# Altium schematic sheet SP26_FindingTitan_Digital Circuitry_Prakul Swaminath.SchDoc.SchDoc
size A; SheetNumber: 6; SheetTotal: 6
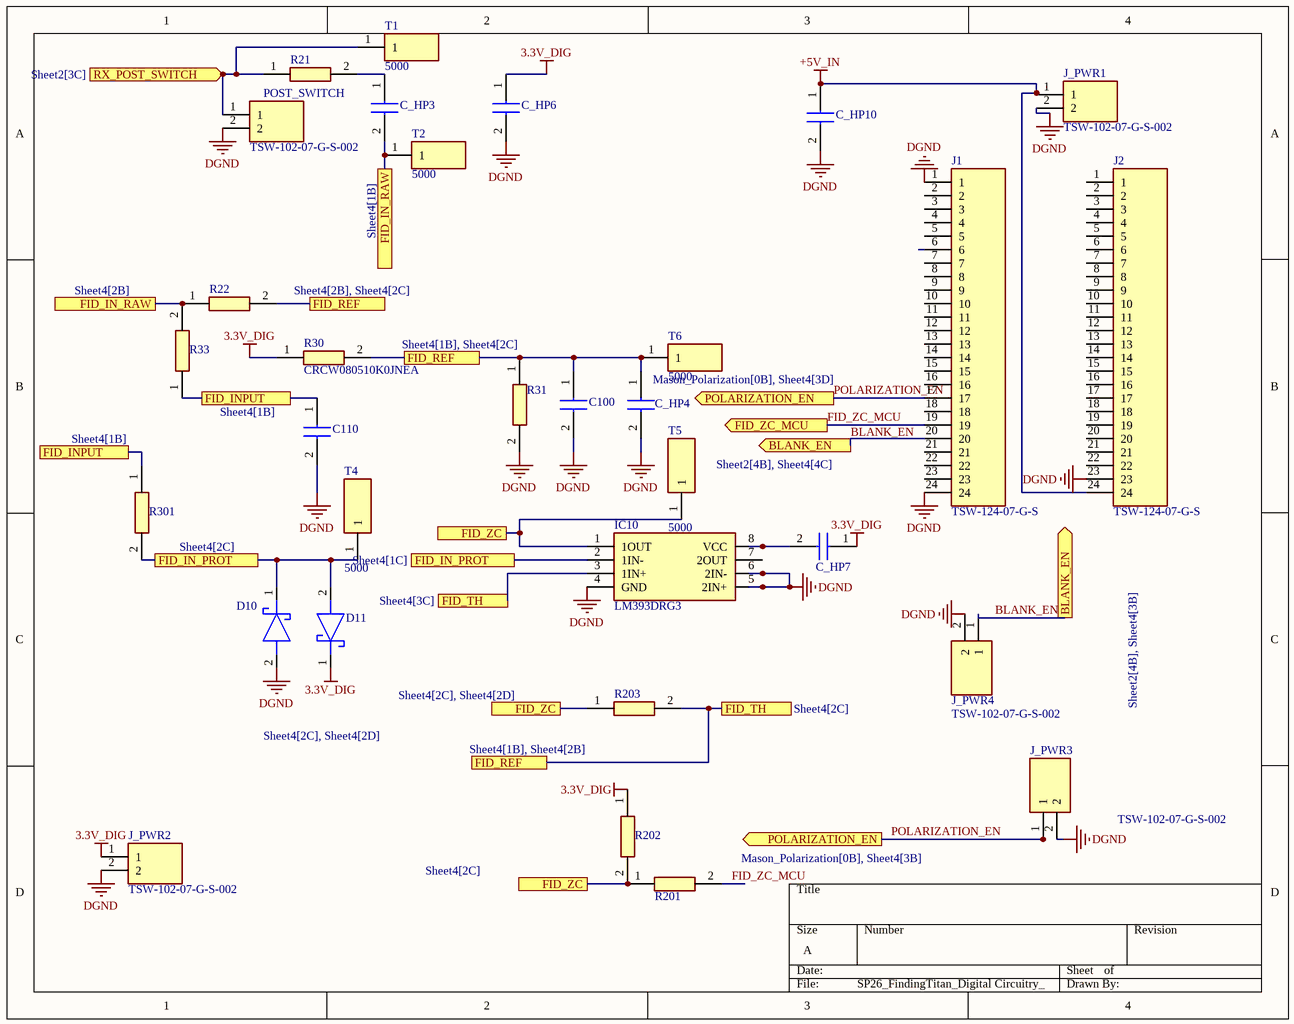
[diagram p0: SP26_FindingTitan_Digital Circuitry_Prakul Swaminath.SchDoc.SchDoc]

## Parts
C100  C0805C105K5RACTU  [C0805]  (value not drawn)
C110  GRM188R71H222KA01D  [CAPC1608X90N]  (value not drawn)
C_HP3  C0603C104K5RACTU7042  [CAPC1608X95N]  (value not drawn)
C_HP4  C0603C104K5RACTU7042C0603C104K5RACTU7042  [CAPC1608X95N]  (value not drawn)
C_HP6  C0603C104K5RACTU7042C0603C104K5RACTU7042  [CAPC1608X95N]  (value not drawn)
C_HP7  C0603C104K5RACTU7042C0603C104K5RACTU7042  [CAPC1608X95N]  (value not drawn)
C_HP10  C0603C104K5RACTU7042C0603C104K5RACTU7042  [CAPC1608X95N]  (value not drawn)
D10  BAT54HT1G  [SOD2512X110N]  (value not drawn)
D11  BAT54HT1G  [SOD2512X110N]  (value not drawn)
IC10  LM393DRG3  [SOIC127P600X175-8N]
J1  TSW-124-07-G-S  [TSW-124-XX-YY-S]
J2  TSW-124-07-G-S  [TSW-124-XX-YY-S]
J_PWR1  TSW-102-07-G-S-002  [HDRV2W64P0X254_1X2_508X254X838P]
J_PWR2  TSW-102-07-G-S-002  [HDRV2W64P0X254_1X2_508X254X838P]
J_PWR3  TSW-102-07-G-S-002  [HDRV2W64P0X254_1X2_508X254X838P]
J_PWR4  TSW-102-07-G-S-002  [HDRV2W64P0X254_1X2_508X254X838P]
POST_SWITCH  TSW-102-07-G-S-002  [HDRV2W64P0X254_1X2_508X254X838P]
R21  RMCF0603FT1K00  [RESC1608X55N]  (value not drawn)
R22  RC0805FR-07100KL  [RESC2012X60N]  (value not drawn)
R30  CRCW080510K0JNEA  [RESC2012X50N]
R31  CRCW080510K0JNEA  [RESC2012X50N]  (value not drawn)
R33  RC0402JR-074K7L  [RESC2012X60N]  (value not drawn)
R201  CRCW080547R0FKEA  [RESC2012X60N]  (value not drawn)
R202  CRCW08054K70FKEA  [RESC2012X60N]  (value not drawn)
R203  CRCW08051M00FKEAHP  [RESC2012X60N]  (value not drawn)
R301  RC0805FR-07220RL  [RESC2012X60N]  (value not drawn)
T1  5000  [5000]
T2  5000  [5000]
T4  5000  [5000]
T5  5000  [5000]
T6  5000  [5000]

## Ports
BLANK_EN (out, see Sheet2[4B], Sheet4[3B]), BLANK_EN (out, see Sheet2[4B], Sheet4[4C]), FID_IN_PROT (see Sheet4[1C]), FID_IN_PROT (see Sheet4[2C]), FID_IN_RAW (see Sheet4[1B]), FID_IN_RAW (see Sheet4[2B]), FID_INPUT (see Sheet4[1B]), FID_REF (see Sheet4[1B], Sheet4[2B]), FID_REF (see Sheet4[1B], Sheet4[2C]), FID_REF (see Sheet4[2B], Sheet4[2C]), FID_TH (see Sheet4[2C]), FID_TH (see Sheet4[3C]), FID_ZC (see Sheet4[2C]), FID_ZC (see Sheet4[2C], Sheet4[2D]), FID_ZC_MCU (out), POLARIZATION_EN (out, see Mason_Polarization[0B], Sheet4[3B]), POLARIZATION_EN (out, see Mason_Polarization[0B], Sheet4[3D]), RX_POST_SWITCH (in, see Sheet2[3C])

## Nets
3.3V_DIG: C_HP6.1 C_HP7.1 D11.1(K) J_PWR2.1 R30.1 R202.1
+5V_IN: C_HP10.1 J2.24 J_PWR1.1
DGND: C100.2 C110.2 C_HP4.2 C_HP6.2 C_HP10.2 D10.2(A) IC10.4(GND) IC10.5(2IN+) IC10.6(2IN-) J1.1 J1.24 J2.23 J_PWR1.2 J_PWR2.2 J_PWR3.2 J_PWR4.2 POST_SWITCH.2 R31.2
BLANK_EN: J1.20 J_PWR4.1 ; port BLANK_EN
FID_IN_PROT: D10.1(K) D11.2(A) IC10.2(1IN-) R301.2 T4.1 ; port FID_IN_PROT
FID_IN_RAW: C_HP3.2 R22.1 R33.2 T2.1 ; port FID_IN_RAW
FID_INPUT: C110.1 R33.1 R301.1 ; port FID_INPUT
FID_REF: C100.1 C_HP4.1 IC10.3(1IN+) R22.2 R30.2 R31.1 R203.2 T6.1 ; port FID_REF, port FID_TH
FID_ZC: IC10.1(1OUT) R201.1 R202.2 R203.1 T5.1 ; port FID_ZC
FID_ZC_MCU: J1.19 R201.2 ; port FID_ZC_MCU
POLARIZATION_EN: J1.17 J_PWR3.1 ; port POLARIZATION_EN
RX_POST_SWITCH: POST_SWITCH.1 R21.1 T1.1 ; port RX_POST_SWITCH
NetC_HP3_1: C_HP3.1 R21.2
NetC_HP7_2: C_HP7.2 IC10.8(VCC)

Not connected (* = marked no-connect by the designer): IC10 7(2OUT); J1 2 3 4 5 6 7 8 9 10 11 12 13 14 15 16 18 21 22 23; J2 1 2 3 4 5 6 7 8 9 10 11 12 13 14 15 16 17 18 19 20 21 22

## Library data of the parts
C100 = C0805C105K5RACTU: Capacitor; Manufacturer_Name: Yageo Group; Datasheet Link: https://www.yageogroup.com/content/datasheet/asset/file/KEM_C1002_X7R_SMD; Height: 1.1mm; Manufacturer_Part_Number: C0805C105K5RACTU; Mouser Part Number: 80-C0805C105K5R; Mouser Price/Stock: https://www.mouser.co.uk/ProductDetail/KEMET/C0805C105K5RACTU?qs=iP0bYSAMAFrBrUflcErrLQ%3D%3D; Arrow Part Number: C0805C105K5RACTU; Arrow Price/Stock: https://www.arrow.com/en/products/c0805c105k5ractu/kemet-corporation?region=nac
C110 = GRM188R71H222KA01D: Capacitor; Manufacturer_Name: Murata Electronics; Datasheet Link: https://search.murata.co.jp/Ceramy/image/img/A01X/G101/ENG/GRM188R71H222KA01-01.pdf; Height: 0.9mm; Manufacturer_Part_Number: GRM188R71H222KA01D; Mouser Part Number: 81-GRM39X222K50D; Mouser Price/Stock: https://www.mouser.co.uk/ProductDetail/Murata-Electronics/GRM188R71H222KA01D?qs=mv1J312wYL%252BkIvLULkLWIw%3D%3D; Arrow Part Number: GRM188R71H222KA01D; Arrow Price/Stock: https://www.arrow.com/en/products/grm188r71h222ka01d/murata-manufacturing?utm_currency=USD&region=europe
C_HP3 C_HP4 C_HP6 C_HP7 C_HP10 = C0603C104K5RACTU7042: Capacitor; Manufacturer_Name: YAGEO; Datasheet Link: https://www.arrow.com/en/products/c0603c104k5ractu7042/kemet-corporation; Height: 0.95mm; Manufacturer_Part_Number: C0603C104K5RACTU7042; Arrow Part Number: C0603C104K5RACTU7042; Arrow Price/Stock: https://www.arrow.com/en/products/c0603c104k5ractu7042/kemet-corporation
D10 D11 = BAT54HT1G: Schottky Diode; Manufacturer_Name: onsemi; Datasheet Link: https://www.onsemi.com/pub/Collateral/BAT54HT1-D.PDF; Height: 1.1mm; Manufacturer_Part_Number: BAT54HT1G; Mouser Part Number: 863-BAT54HT1G; Mouser Price/Stock: https://www.mouser.co.uk/ProductDetail/onsemi/BAT54HT1G?qs=vLkC5FC1VN%252BK3ZQA%252ByHPIA%3D%3D; Arrow Part Number: BAT54HT1G; Arrow Price/Stock: https://www.arrow.com/en/products/bat54ht1g/on-semiconductor?utm_currency=USD&region=europe
IC10 = LM393DRG3: Integrated Circuit; Manufacturer_Name: Texas Instruments; Datasheet Link: http://www.ti.com/lit/gpn/lm393; Height: 1.75mm; Manufacturer_Part_Number: LM393DRG3; Mouser Part Number: 595-LM393DRG3; Mouser Price/Stock: https://www.mouser.co.uk/ProductDetail/Texas-Instruments/LM393DRG3?qs=EuM%2FBx4ov4Qjo1J98GenvQ%3D%3D; Arrow Part Number: LM393DRG3; Arrow Price/Stock: https://www.arrow.com/en/products/lm393drg3/texas-instruments.html?utm_currency=USD&region=nac
J1 J2 = TSW-124-07-G-S: Connector; Manufacturer_Name: SAMTEC; Datasheet Link: http://suddendocs.samtec.com/prints/tsw-xxx-xx-xxx-x-xx-xxx-mkt.pdf; Manufacturer_Part_Number: TSW-124-07-G-S; Mouser Part Number: 200-TSW12407GS; Mouser Price/Stock: https://www.mouser.co.uk/ProductDetail/Samtec/TSW-124-07-G-S?qs=rU5fayqh%252BE3R3972xmCA0A%3D%3D; Arrow Part Number: TSW-124-07-G-S; Arrow Price/Stock: https://www.arrow.com/en/products/tsw-124-07-g-s/samtec
J_PWR1-J_PWR4 POST_SWITCH = TSW-102-07-G-S-002: Connector; Manufacturer_Name: SAMTEC; Datasheet Link: http://suddendocs.samtec.com/prints/tsw-xxx-xx-xxx-x-xx-xxx-mkt.pdf; Height: 8.38mm; Manufacturer_Part_Number: TSW-102-07-G-S-002; Mouser Part Number: 200-TSW-10207GS002; Mouser Price/Stock: https://www.mouser.co.uk/ProductDetail/Samtec/TSW-102-07-G-S-002?qs=icabnvfcbsHvpvHCodBv1Q%3D%3D; Arrow Part Number: TSW-102-07-G-S-002; Arrow Price/Stock: https://www.arrow.com/en/products/tsw-102-07-g-s-002/samtec?utm_currency=USD&region=nac
R21 = RMCF0603FT1K00: Resistor; Manufacturer_Name: Stackpole Electronics; Datasheet Link: https://www.seielect.com/Catalog/SEI-RMCF_RMCP.pdf; Height: 0.55mm; Manufacturer_Part_Number: RMCF0603FT1K00; Mouser Part Number: 708-RMCF0603FT1K00; Mouser Price/Stock: https://www.mouser.co.uk/ProductDetail/SEI-Stackpole/RMCF0603FT1K00?qs=FESYatJ8odI%252BYiPlprc1Pg%3D%3D; Arrow Part Number: RMCF0603FT1K00; Arrow Price/Stock: https://www.arrow.com/en/products/rmcf0603ft1k00/stackpole-electronics?utm_currency=USD&region=nac
R22 R33 = RC0805FR-07100KL: Resistor; Manufacturer_Name: YAGEO; Datasheet Link: http://www.yageo.com/documents/recent/PYu-RC_Group_51_RoHS_L_10.pdf; Height: 0.6mm; Manufacturer_Part_Number: RC0805FR-07100KL; Mouser Part Number: 603-RC0805FR-07100KL; Mouser Price/Stock: https://www.mouser.co.uk/ProductDetail/YAGEO/RC0805FR-07100KL?qs=8Y8p%252BasKcI7rEWn6FcVdAA%3D%3D; Arrow Part Number: RC0805FR-07100KL; Arrow Price/Stock: https://www.arrow.com/en/products/rc0805fr-07100kl/yageo?region=nac
R30 R31 = CRCW080510K0JNEA: Resistor; Manufacturer_Name: Vishay; Datasheet Link: http://www.vishay.com/docs/20035/dcrcwe3.pdf; Height: 0.5mm; Manufacturer_Part_Number: CRCW080510K0JNEA; Mouser Part Number: 71-CRCW0805J-10K-E3; Mouser Price/Stock: https://www.mouser.co.uk/ProductDetail/Vishay-Dale/CRCW080510K0JNEA?qs=LOX6nxTstiZtNB6HA62jyQ%3D%3D; Arrow Part Number: CRCW080510K0JNEA; Arrow Price/Stock: https://www.arrow.com/en/products/crcw080510k0jnea/vishay.html?utm_currency=USD&region=nac
R201 R202 = CRCW080510K0FKEAHP: Resistor; Manufacturer_Name: Vishay; Datasheet Link: https://componentsearchengine.com/Datasheets/1/CRCW08051R00FKEAHP.pdf; Height: 0.6mm; Manufacturer_Part_Number: CRCW080510K0FKEAHP; Mouser Part Number: 71-CRCW080510K0FKEAH; Mouser Price/Stock: https://www.mouser.co.uk/ProductDetail/Vishay-Dale/CRCW080510K0FKEAHP?qs=FlFvgi4rxBybVOW6oiRQjA%3D%3D; Arrow Part Number: CRCW080510K0FKEAHP; Arrow Price/Stock: https://www.arrow.com/en/products/crcw080510k0fkeahp/vishay.html?utm_currency=USD&region=europe
R203 = CRCW08051M00FKEAHP: Resistor; Manufacturer_Name: Vishay; Datasheet Link: https://componentsearchengine.com/Datasheets/1/CRCW08051R00FKEAHP.pdf; Height: 0.6mm; Manufacturer_Part_Number: CRCW08051M00FKEAHP; Mouser Part Number: 71-CRCW08051M00FKEAH; Mouser Price/Stock: https://www.mouser.co.uk/ProductDetail/Vishay-Dale/CRCW08051M00FKEAHP?qs=k2%2FDWSARqgF%252BgsChW9CloQ%3D%3D; Arrow Part Number: CRCW08051M00FKEAHP; Arrow Price/Stock: https://www.arrow.com/en/products/crcw08051m00fkeahp/vishay?utm_currency=USD&region=nac
R301 = RC0805FR-07220RL: Resistor; Manufacturer_Name: YAGEO; Datasheet Link: http://www.yageo.com/documents/recent/PYu-RC_Group_51_RoHS_L_10.pdf; Height: 0.6mm; Manufacturer_Part_Number: RC0805FR-07220RL; Mouser Part Number: 603-RC0805FR-07220RL; Mouser Price/Stock: https://www.mouser.co.uk/ProductDetail/Yageo/RC0805FR-07220RL/?qs=KCkj9j0IqmXa4o%252BHKR6RGw%3D%3D; Arrow Part Number: RC0805FR-07220RL; Arrow Price/Stock: https://www.arrow.com/en/products/rc0805fr-07220rl/yageo?region=nac
T1 T2 T4-T6 = 5000: Connector; Manufacturer_Name: Keystone Electronics; Datasheet Link: http://www.keyelco.com/product-pdf.cfm?p=1309; Manufacturer_Part_Number: 5000; Mouser Part Number: 534-5000; Mouser Price/Stock: https://www.mouser.co.uk/ProductDetail/Keystone-Electronics/5000?qs=q0tsjPZWdm%252B9SiiTAbEwUw%3D%3D; Arrow Part Number: 5000; Arrow Price/Stock: https://www.arrow.com/en/products/5000/keystone-electronics.html?utm_currency=USD&region=europe